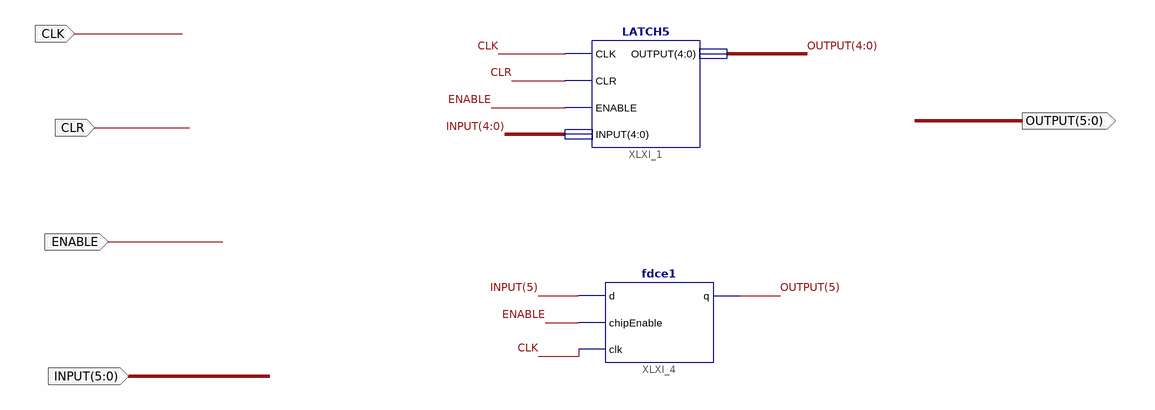
[diagram p0: schematic sheet 1]
// Xilinx ISE schematic LATCH6.sch (artix7) as structural Verilog: 2 symbols, 5 ports
module LATCH6 (
  input  CLK,
  input  CLR,
  input  ENABLE,
  input  [5:0] INPUT,
  output [5:0] OUTPUT
);

  LATCH5 XLXI_1 (.CLK(CLK), .CLR(CLR), .ENABLE(ENABLE), .INPUT(INPUT[4:0]), .OUTPUT(OUTPUT[4:0]));
  fdce1 XLXI_4 (.clk(CLK), .chipEnable(ENABLE), .d(INPUT[5]), .q(OUTPUT[5]));
endmodule
